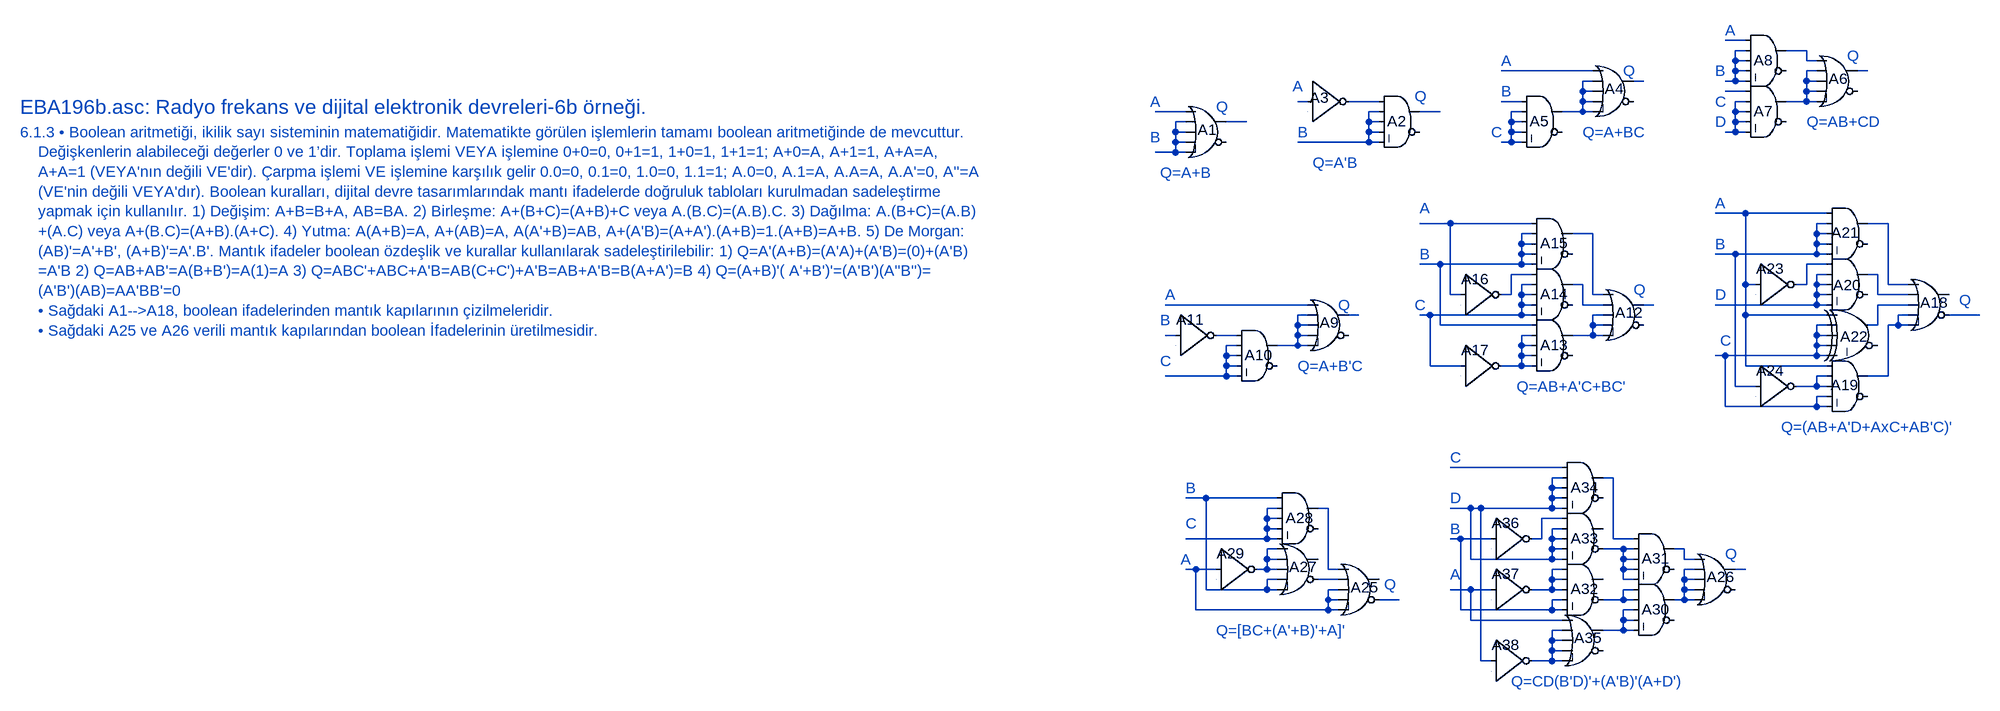
[diagram p0: schematic EBA196b.asc]
EBA196b.asc, the LTspice schematic file:
Version 4
SHEET 1 7064 4332
WIRE 2480 -48 2448 -48
WIRE 2480 -32 2464 -32
WIRE 2576 -32 2544 -32
WIRE 2464 -16 2464 -32
WIRE 2480 -16 2464 -16
WIRE 2576 -16 2576 -32
WIRE 2592 -16 2576 -16
WIRE 2240 0 2096 0
WIRE 2464 0 2464 -16
WIRE 2480 0 2464 0
WIRE 2592 0 2576 0
WIRE 2672 0 2656 0
WIRE 2240 16 2224 16
WIRE 2320 16 2304 16
WIRE 2464 16 2464 0
WIRE 2464 16 2448 16
WIRE 2480 16 2464 16
WIRE 2576 16 2576 0
WIRE 2592 16 2576 16
WIRE 2224 32 2224 16
WIRE 2240 32 2224 32
WIRE 2480 32 2448 32
WIRE 2576 32 2576 16
WIRE 2592 32 2576 32
WIRE 1792 48 1776 48
WIRE 1904 48 1856 48
WIRE 2128 48 2096 48
WIRE 2224 48 2224 32
WIRE 2240 48 2224 48
WIRE 2480 48 2464 48
WIRE 2576 48 2576 32
WIRE 2576 48 2544 48
WIRE 2592 48 2576 48
WIRE 1600 64 1552 64
WIRE 1904 64 1888 64
WIRE 2000 64 1968 64
WIRE 2128 64 2112 64
WIRE 2224 64 2224 48
WIRE 2224 64 2192 64
WIRE 2240 64 2224 64
WIRE 2464 64 2464 48
WIRE 2480 64 2464 64
WIRE 1600 80 1584 80
WIRE 1696 80 1664 80
WIRE 1888 80 1888 64
WIRE 1904 80 1888 80
WIRE 2112 80 2112 64
WIRE 2128 80 2112 80
WIRE 2464 80 2464 64
WIRE 2480 80 2464 80
WIRE 1584 96 1584 80
WIRE 1600 96 1584 96
WIRE 1888 96 1888 80
WIRE 1904 96 1888 96
WIRE 2112 96 2112 80
WIRE 2128 96 2112 96
WIRE 2464 96 2464 80
WIRE 2464 96 2448 96
WIRE 2480 96 2464 96
WIRE 1584 112 1584 96
WIRE 1600 112 1584 112
WIRE 1888 112 1888 96
WIRE 1888 112 1776 112
WIRE 1904 112 1888 112
WIRE 2112 112 2112 96
WIRE 2112 112 2096 112
WIRE 2128 112 2112 112
WIRE 1584 128 1584 112
WIRE 1584 128 1552 128
WIRE 1600 128 1584 128
WIRE 2480 224 2432 224
WIRE 2608 224 2480 224
WIRE 2016 240 1968 240
WIRE 2144 240 2016 240
WIRE 2608 240 2592 240
WIRE 2704 240 2672 240
WIRE 2144 256 2128 256
WIRE 2240 256 2208 256
WIRE 2592 256 2592 240
WIRE 2608 256 2592 256
WIRE 2128 272 2128 256
WIRE 2144 272 2128 272
WIRE 2592 272 2592 256
WIRE 2608 272 2592 272
WIRE 2128 288 2128 272
WIRE 2144 288 2128 288
WIRE 2464 288 2432 288
WIRE 2592 288 2592 272
WIRE 2592 288 2464 288
WIRE 2608 288 2592 288
WIRE 2000 304 1968 304
WIRE 2128 304 2128 288
WIRE 2128 304 2000 304
WIRE 2144 304 2128 304
WIRE 2608 304 2576 304
WIRE 2144 320 2112 320
WIRE 2608 320 2592 320
WIRE 2688 320 2672 320
WIRE 2144 336 2128 336
WIRE 2224 336 2208 336
WIRE 2480 336 2480 224
WIRE 2496 336 2480 336
WIRE 2576 336 2576 304
WIRE 2576 336 2560 336
WIRE 2592 336 2592 320
WIRE 2608 336 2592 336
WIRE 2704 336 2704 240
WIRE 2736 336 2704 336
WIRE 2016 352 2016 240
WIRE 2032 352 2016 352
WIRE 2112 352 2112 320
WIRE 2112 352 2096 352
WIRE 2128 352 2128 336
WIRE 2144 352 2128 352
WIRE 2240 352 2240 256
WIRE 2256 352 2240 352
WIRE 2592 352 2592 336
WIRE 2608 352 2592 352
WIRE 2688 352 2688 320
WIRE 2736 352 2688 352
WIRE 1792 368 1568 368
WIRE 2128 368 2128 352
WIRE 2144 368 2128 368
WIRE 2224 368 2224 336
WIRE 2256 368 2224 368
WIRE 2336 368 2320 368
WIRE 2592 368 2592 352
WIRE 2592 368 2432 368
WIRE 2608 368 2592 368
WIRE 2736 368 2688 368
WIRE 1792 384 1776 384
WIRE 1872 384 1856 384
WIRE 1984 384 1968 384
WIRE 2128 384 2128 368
WIRE 2128 384 1984 384
WIRE 2144 384 2128 384
WIRE 2256 384 2240 384
WIRE 2480 384 2480 336
WIRE 2608 384 2480 384
WIRE 2736 384 2720 384
WIRE 2848 384 2800 384
WIRE 1776 400 1776 384
WIRE 1792 400 1776 400
WIRE 2000 400 2000 304
WIRE 2144 400 2000 400
WIRE 2240 400 2240 384
WIRE 2256 400 2240 400
WIRE 2608 400 2592 400
WIRE 2688 400 2688 368
WIRE 2688 400 2672 400
WIRE 2720 400 2720 384
WIRE 2720 400 2704 400
WIRE 2736 400 2720 400
WIRE 1584 416 1568 416
WIRE 1680 416 1648 416
WIRE 1776 416 1776 400
WIRE 1792 416 1776 416
WIRE 2144 416 2128 416
WIRE 2240 416 2240 400
WIRE 2240 416 2208 416
WIRE 2256 416 2240 416
WIRE 2592 416 2592 400
WIRE 2608 416 2592 416
WIRE 1680 432 1664 432
WIRE 1776 432 1776 416
WIRE 1776 432 1744 432
WIRE 1792 432 1776 432
WIRE 2128 432 2128 416
WIRE 2144 432 2128 432
WIRE 2592 432 2592 416
WIRE 2608 432 2592 432
WIRE 1664 448 1664 432
WIRE 1680 448 1664 448
WIRE 2128 448 2128 432
WIRE 2144 448 2128 448
WIRE 2448 448 2432 448
WIRE 2592 448 2592 432
WIRE 2592 448 2448 448
WIRE 2608 448 2592 448
WIRE 1664 464 1664 448
WIRE 1680 464 1664 464
WIRE 1984 464 1984 384
WIRE 2032 464 1984 464
WIRE 2128 464 2128 448
WIRE 2128 464 2096 464
WIRE 2144 464 2128 464
WIRE 2480 464 2480 384
WIRE 2608 464 2480 464
WIRE 1664 480 1664 464
WIRE 1664 480 1568 480
WIRE 1680 480 1664 480
WIRE 2608 480 2592 480
WIRE 2704 480 2704 400
WIRE 2704 480 2672 480
WIRE 2464 496 2464 288
WIRE 2496 496 2464 496
WIRE 2592 496 2592 480
WIRE 2592 496 2560 496
WIRE 2608 496 2592 496
WIRE 2608 512 2592 512
WIRE 2448 528 2448 448
WIRE 2592 528 2592 512
WIRE 2592 528 2448 528
WIRE 2608 528 2592 528
WIRE 2192 624 2016 624
WIRE 2192 640 2176 640
WIRE 2272 640 2256 640
WIRE 2176 656 2176 640
WIRE 2192 656 2176 656
WIRE 1632 672 1600 672
WIRE 1744 672 1632 672
WIRE 2176 672 2176 656
WIRE 2192 672 2176 672
WIRE 1744 688 1728 688
WIRE 1824 688 1808 688
WIRE 2048 688 2016 688
WIRE 2064 688 2048 688
WIRE 2176 688 2176 672
WIRE 2176 688 2064 688
WIRE 2192 688 2176 688
WIRE 1728 704 1728 688
WIRE 1744 704 1728 704
WIRE 2192 704 2160 704
WIRE 1728 720 1728 704
WIRE 1744 720 1728 720
WIRE 2192 720 2176 720
WIRE 1728 736 1728 720
WIRE 1728 736 1600 736
WIRE 1744 736 1728 736
WIRE 2032 736 2016 736
WIRE 2080 736 2032 736
WIRE 2160 736 2160 704
WIRE 2160 736 2144 736
WIRE 2176 736 2176 720
WIRE 2192 736 2176 736
WIRE 2272 736 2272 640
WIRE 2304 736 2272 736
WIRE 1744 752 1728 752
WIRE 2176 752 2176 736
WIRE 2192 752 2176 752
WIRE 2288 752 2256 752
WIRE 2304 752 2288 752
WIRE 2384 752 2368 752
WIRE 1728 768 1728 752
WIRE 1744 768 1728 768
WIRE 2048 768 2048 688
WIRE 2176 768 2176 752
WIRE 2176 768 2048 768
WIRE 2192 768 2176 768
WIRE 2288 768 2288 752
WIRE 2304 768 2288 768
WIRE 2384 768 2384 752
WIRE 2400 768 2384 768
WIRE 1616 784 1600 784
WIRE 1648 784 1616 784
WIRE 1728 784 1728 768
WIRE 1728 784 1712 784
WIRE 1744 784 1728 784
WIRE 1824 784 1824 688
WIRE 1840 784 1824 784
WIRE 2192 784 2176 784
WIRE 2288 784 2288 768
WIRE 2304 784 2288 784
WIRE 2400 784 2384 784
WIRE 2480 784 2464 784
WIRE 1744 800 1728 800
WIRE 1840 800 1808 800
WIRE 2176 800 2176 784
WIRE 2192 800 2176 800
WIRE 2288 800 2288 784
WIRE 2304 800 2288 800
WIRE 2384 800 2384 784
WIRE 2400 800 2384 800
WIRE 1632 816 1632 672
WIRE 1728 816 1728 800
WIRE 1728 816 1632 816
WIRE 1744 816 1728 816
WIRE 1840 816 1824 816
WIRE 2048 816 2016 816
WIRE 2080 816 2048 816
WIRE 2176 816 2176 800
WIRE 2176 816 2144 816
WIRE 2192 816 2176 816
WIRE 2304 816 2288 816
WIRE 2384 816 2384 800
WIRE 2400 816 2384 816
WIRE 1824 832 1824 816
WIRE 1840 832 1824 832
WIRE 1936 832 1904 832
WIRE 2192 832 2176 832
WIRE 2288 832 2288 816
WIRE 2288 832 2256 832
WIRE 2304 832 2288 832
WIRE 2384 832 2384 816
WIRE 2384 832 2368 832
WIRE 2400 832 2384 832
WIRE 1616 848 1616 784
WIRE 1824 848 1824 832
WIRE 1824 848 1616 848
WIRE 1840 848 1824 848
WIRE 2032 848 2032 736
WIRE 2176 848 2176 832
WIRE 2176 848 2032 848
WIRE 2192 848 2176 848
WIRE 2304 848 2288 848
WIRE 2048 864 2048 816
WIRE 2192 864 2048 864
WIRE 2288 864 2288 848
WIRE 2304 864 2288 864
WIRE 2192 880 2176 880
WIRE 2288 880 2288 864
WIRE 2288 880 2256 880
WIRE 2304 880 2288 880
WIRE 2176 896 2176 880
WIRE 2192 896 2176 896
WIRE 2176 912 2176 896
WIRE 2192 912 2176 912
WIRE 2064 928 2064 688
WIRE 2080 928 2064 928
WIRE 2176 928 2176 912
WIRE 2176 928 2144 928
WIRE 2192 928 2176 928
SYMBOL Digital\\or 1632 32 R0
WINDOW 0 -13 60 Left 2
SYMATTR InstName A1
SYMBOL Digital\\and 1936 16 R0
WINDOW 0 -19 63 Left 2
SYMATTR InstName A2
SYMBOL Digital\\inv 1792 -16 R0
WINDOW 0 3 58 Left 2
SYMATTR InstName A3
SYMBOL Digital\\or 2272 -32 R0
WINDOW 0 -13 60 Left 2
SYMATTR InstName A4
SYMBOL Digital\\and 2160 16 R0
WINDOW 0 -19 63 Left 2
SYMATTR InstName A5
SYMBOL Digital\\or 2624 -48 R0
WINDOW 0 -13 60 Left 2
SYMATTR InstName A6
SYMBOL Digital\\and 2512 0 R0
WINDOW 0 -19 63 Left 2
SYMATTR InstName A7
SYMBOL Digital\\and 2512 -80 R0
WINDOW 0 -19 63 Left 2
SYMATTR InstName A8
SYMBOL Digital\\or 1824 336 R0
WINDOW 0 -13 60 Left 2
SYMATTR InstName A9
SYMBOL Digital\\and 1712 384 R0
WINDOW 0 -19 63 Left 2
SYMATTR InstName A10
SYMBOL Digital\\inv 1584 352 R0
WINDOW 0 1 39 Left 2
SYMATTR InstName A11
SYMBOL Digital\\or 2288 320 R0
WINDOW 0 -13 60 Left 2
SYMATTR InstName A12
SYMBOL Digital\\and 2176 368 R0
WINDOW 0 -19 63 Left 2
SYMATTR InstName A13
SYMBOL Digital\\and 2176 288 R0
WINDOW 0 -19 63 Left 2
SYMATTR InstName A14
SYMBOL Digital\\and 2176 208 R0
WINDOW 0 -19 63 Left 2
SYMATTR InstName A15
SYMBOL Digital\\inv 2032 288 R0
WINDOW 0 1 39 Left 2
SYMATTR InstName A16
SYMBOL Digital\\inv 2032 400 R0
WINDOW 0 1 39 Left 2
SYMATTR InstName A17
SYMBOL Digital\\or 2768 304 R0
WINDOW 0 -13 60 Left 2
SYMATTR InstName A18
SYMBOL Digital\\and 2640 432 R0
WINDOW 0 -26 62 Left 2
SYMATTR InstName A19
SYMBOL Digital\\and 2640 272 R0
WINDOW 0 -22 65 Left 2
SYMATTR InstName A20
SYMBOL Digital\\and 2640 192 R0
WINDOW 0 -25 62 Left 2
SYMATTR InstName A21
SYMBOL Digital\\xor 2656 352 R0
WINDOW 0 -27 66 Left 2
SYMATTR InstName A22
SYMBOL Digital\\inv 2496 272 R0
WINDOW 0 1 39 Left 2
SYMATTR InstName A23
SYMBOL Digital\\inv 2496 432 R0
WINDOW 0 1 39 Left 2
SYMATTR InstName A24
SYMBOL Digital\\or 1872 752 R0
WINDOW 0 -13 60 Left 2
SYMATTR InstName A25
SYMBOL Digital\\and 1776 640 R0
WINDOW 0 -19 63 Left 2
SYMATTR InstName A28
SYMBOL Digital\\inv 1648 720 R0
WINDOW 0 1 39 Left 2
SYMATTR InstName A29
SYMBOL Digital\\or 1776 720 R0
WINDOW 0 -13 60 Left 2
SYMATTR InstName A27
SYMBOL Digital\\or 2432 736 R0
WINDOW 0 -13 60 Left 2
SYMATTR InstName A26
SYMBOL Digital\\and 2336 784 R0
WINDOW 0 -19 63 Left 2
SYMATTR InstName A30
SYMBOL Digital\\and 2336 704 R0
WINDOW 0 -19 63 Left 2
SYMATTR InstName A31
SYMBOL Digital\\and 2224 752 R0
WINDOW 0 -19 63 Left 2
SYMATTR InstName A32
SYMBOL Digital\\and 2224 672 R0
WINDOW 0 -19 63 Left 2
SYMATTR InstName A33
SYMBOL Digital\\and 2224 592 R0
WINDOW 0 -19 63 Left 2
SYMATTR InstName A34
SYMBOL Digital\\or 2224 832 R0
WINDOW 0 -13 60 Left 2
SYMATTR InstName A35
SYMBOL Digital\\inv 2080 672 R0
WINDOW 0 1 39 Left 2
SYMATTR InstName A36
SYMBOL Digital\\inv 2080 752 R0
WINDOW 0 1 39 Left 2
SYMATTR InstName A37
SYMBOL Digital\\inv 2080 864 R0
WINDOW 0 1 39 Left 2
SYMATTR InstName A38
TEXT -232 56 Left 3 ;EBA196b.asc: Radyo frekans ve dijital elektronik devreleri-6b örneği.
TEXT -232 96 Left 2 ;6.1.3 • Boolean aritmetiği, ikilik sayı sisteminin matematiğidir. Matematikte görülen işlemlerin tamamı boolean aritmetiğinde de mevcuttur. \n    Değişkenlerin alabileceği değerler 0 ve 1’dir. Toplama işlemi VEYA işlemine 0+0=0, 0+1=1, 1+0=1, 1+1=1; A+0=A, A+1=1, A+A=A,\n    A+A=1 (VEYA'nın değili VE'dir). Çarpma işlemi VE işlemine karşılık gelir 0.0=0, 0.1=0, 1.0=0, 1.1=1; A.0=0, A.1=A, A.A=A, A.A'=0, A''=A\n    (VE'nin değili VEYA'dır). Boolean kuralları, dijital devre tasarımlarındak mantı ifadelerde doğruluk tabloları kurulmadan sadeleştirme \n    yapmak için kullanılır. 1) Değişim: A+B=B+A, AB=BA. 2) Birleşme: A+(B+C)=(A+B)+C veya A.(B.C)=(A.B).C. 3) Dağılma: A.(B+C)=(A.B)\n    +(A.C) veya A+(B.C)=(A+B).(A+C). 4) Yutma: A(A+B)=A, A+(AB)=A, A(A'+B)=AB, A+(A'B)=(A+A').(A+B)=1.(A+B)=A+B. 5) De Morgan:\n    (AB)'=A'+B', (A+B)'=A'.B'. Mantık ifadeler boolean özdeşlik ve kurallar kullanılarak sadeleştirilebilir: 1) Q=A'(A+B)=(A'A)+(A'B)=(0)+(A'B)\n    =A'B 2) Q=AB+AB'=A(B+B')=A(1)=A 3) Q=ABC'+ABC+A'B=AB(C+C')+A'B=AB+A'B=B(A+A')=B 4) Q=(A+B)'( A'+B')'=(A'B')(A''B'')=\n    (A'B')(AB)=AA'BB'=0\n    • Sağdaki A1-->A18, boolean ifadelerinden mantık kapılarının çizilmeleridir.\n    • Sağdaki A25 ve A26 verili mantık kapılarından boolean İfadelerinin üretilmesidir.
TEXT 1560 160 Left 2 ;Q=A+B
TEXT 1544 48 Left 2 ;A
TEXT 1544 104 Left 2 ;B
TEXT 1648 56 Left 2 ;Q
TEXT 1960 40 Left 2 ;Q
TEXT 1768 24 Left 2 ;A
TEXT 1776 96 Left 2 ;B
TEXT 1800 144 Left 2 ;Q=A'B
TEXT 2224 96 Left 2 ;Q=A+BC
TEXT 2096 -16 Left 2 ;A
TEXT 2288 0 Left 2 ;Q
TEXT 2096 32 Left 2 ;B
TEXT 2080 96 Left 2 ;C
TEXT 2576 80 Left 2 ;Q=AB+CD
TEXT 2448 -64 Left 2 ;A
TEXT 2640 -24 Left 2 ;Q
TEXT 2432 0 Left 2 ;B
TEXT 2432 80 Left 2 ;D
TEXT 2432 48 Left 2 ;C
TEXT 1776 464 Left 2 ;Q=A+B'C
TEXT 1568 352 Left 2 ;A
TEXT 1840 368 Left 2 ;Q
TEXT 1560 392 Left 2 ;B
TEXT 1560 456 Left 2 ;C
TEXT 2120 496 Left 2 ;Q=AB+A'C+BC'
TEXT 2304 344 Left 2 ;Q
TEXT 1960 368 Left 2 ;C
TEXT 1968 216 Left 2 ;A
TEXT 1968 288 Left 2 ;B
TEXT 2536 560 Left 2 ;Q=(AB+A'D+AxC+AB'C)'
TEXT 2816 360 Left 2 ;Q
TEXT 2432 208 Left 2 ;A
TEXT 2432 272 Left 2 ;B
TEXT 2432 352 Left 2 ;D
TEXT 2440 424 Left 2 ;C
TEXT 1648 880 Left 2 ;Q=[BC+(A'+B)'+A]'
TEXT 1912 808 Left 2 ;Q
TEXT 1600 712 Left 2 ;C
TEXT 1592 768 Left 2 ;A
TEXT 1600 656 Left 2 ;B
TEXT 2112 960 Left 2 ;Q=CD(B'D)'+(A'B)'(A+D')
TEXT 2448 760 Left 2 ;Q
TEXT 2016 608 Left 2 ;C
TEXT 2016 672 Left 2 ;D
TEXT 2016 720 Left 2 ;B
TEXT 2016 792 Left 2 ;A

The netlist it stands for:
* EBA196b.asc
A1 N014 N018 N018 N018 N018 0 N019 0 OR
A2 N011 N015 N015 N015 N015 0 N016 0 AND
A3 N010 0 0 0 0 N011 0 0 BUF
A4 N004 N007 N007 N007 N007 0 N008 0 OR
A5 N012 N017 N017 N017 N017 0 N007 0 AND
A6 N003 N005 N005 N005 N005 0 N006 0 OR
A7 N009 N013 N013 N013 N013 0 N005 0 AND
A8 N001 N002 N002 N002 N002 0 N003 0 AND
A9 N032 N035 N035 N035 N035 0 N036 0 OR
A10 N042 N044 N044 N044 N044 0 N035 0 AND
A11 N041 0 0 0 0 N042 0 0 BUF
A12 N025 N031 N037 N037 N037 0 N033 0 OR
A13 N024 N043 N043 N043 N043 0 N037 0 AND
A14 N027 N030 N030 N030 N030 0 N031 0 AND
A15 N021 N024 N024 N024 N024 0 N025 0 AND
A16 N021 0 0 0 0 N027 0 0 BUF
A17 N030 0 0 0 0 N043 0 0 BUF
A18 N023 N029 N034 N038 N038 N039 0 0 OR
A19 N020 N045 N045 N040 N040 0 N038 0 AND
A20 N026 N028 N028 N028 N028 0 N029 0 AND
A21 N020 N022 N022 N022 N022 0 N023 0 AND
A22 N020 N040 N040 N040 N040 0 N034 0 XOR
A23 N020 0 0 0 0 N026 0 0 BUF
A24 N022 0 0 0 0 N045 0 0 BUF
A25 N051 N061 N057 N057 N057 N064 0 0 OR
A28 N049 N050 N050 N050 N050 0 N051 0 AND
A29 N057 0 0 0 0 N054 0 0 BUF
A27 N054 N054 N054 N049 N049 N061 0 0 OR
A26 N056 N059 N059 N059 N059 0 N060 0 OR
A30 N063 N063 N065 N065 N065 0 N059 0 AND
A31 N048 N055 N055 N055 N055 0 N056 0 AND
A32 N058 N058 N058 N053 N053 N063 0 0 AND
A33 N052 N047 N047 N047 N047 N055 0 0 AND
A34 N046 N047 N047 N047 N047 0 N048 0 AND
A35 N062 N066 N066 N066 N066 0 N065 0 OR
A36 N053 0 0 0 0 N052 0 0 BUF
A37 N062 0 0 0 0 N058 0 0 BUF
A38 N047 0 0 0 0 N066 0 0 BUF
* EBA196b.asc: Radyo frekans ve dijital elektronik devreleri-6b örneği.
* 6.1.3 • Boolean aritmetiği, ikilik sayı sisteminin matematiğidir. Matematikte görülen işlemlerin tamamı boolean aritmetiğinde de mevcuttur.
*     Değişkenlerin alabileceği değerler 0 ve 1’dir. Toplama işlemi VEYA işlemine 0+0=0, 0+1=1, 1+0=1, 1+1=1; A+0=A, A+1=1, A+A=A,
*     A+A=1 (VEYA'nın değili VE'dir). Çarpma işlemi VE işlemine karşılık gelir 0.0=0, 0.1=0, 1.0=0, 1.1=1; A.0=0, A.1=A, A.A=A, A.A'=0, A''=A
*     (VE'nin değili VEYA'dır). Boolean kuralları, dijital devre tasarımlarındak mantı ifadelerde doğruluk tabloları kurulmadan sadeleştirme
*     yapmak için kullanılır. 1) Değişim: A+B=B+A, AB=BA. 2) Birleşme: A+(B+C)=(A+B)+C veya A.(B.C)=(A.B).C. 3) Dağılma: A.(B+C)=(A.B)
*     +(A.C) veya A+(B.C)=(A+B).(A+C). 4) Yutma: A(A+B)=A, A+(AB)=A, A(A'+B)=AB, A+(A'B)=(A+A').(A+B)=1.(A+B)=A+B. 5) De Morgan:
*     (AB)'=A'+B', (A+B)'=A'.B'. Mantık ifadeler boolean özdeşlik ve kurallar kullanılarak sadeleştirilebilir: 1) Q=A'(A+B)=(A'A)+(A'B)=(0)+(A'B)
*     =A'B 2) Q=AB+AB'=A(B+B')=A(1)=A 3) Q=ABC'+ABC+A'B=AB(C+C')+A'B=AB+A'B=B(A+A')=B 4) Q=(A+B)'( A'+B')'=(A'B')(A''B'')=
*     (A'B')(AB)=AA'BB'=0
*     • Sağdaki A1-->A18, boolean ifadelerinden mantık kapılarının çizilmeleridir.
*     • Sağdaki A25 ve A26 verili mantık kapılarından boolean İfadelerinin üretilmesidir.
* Q=A+B
* A
* B
* Q
* Q
* A
* B
* Q=A'B
* Q=A+BC
* A
* Q
* B
* C
* Q=AB+CD
* A
* Q
* B
* D
* C
* Q=A+B'C
* A
* Q
* B
* C
* Q=AB+A'C+BC'
* Q
* C
* A
* B
* Q=(AB+A'D+AxC+AB'C)'
* Q
* A
* B
* D
* C
* Q=[BC+(A'+B)'+A]'
* Q
* C
* A
* B
* Q=CD(B'D)'+(A'B)'(A+D')
* Q
* C
* D
* B
* A
.backanno
.end